# EAGLE design ESP (EAGLE 7.6.0)
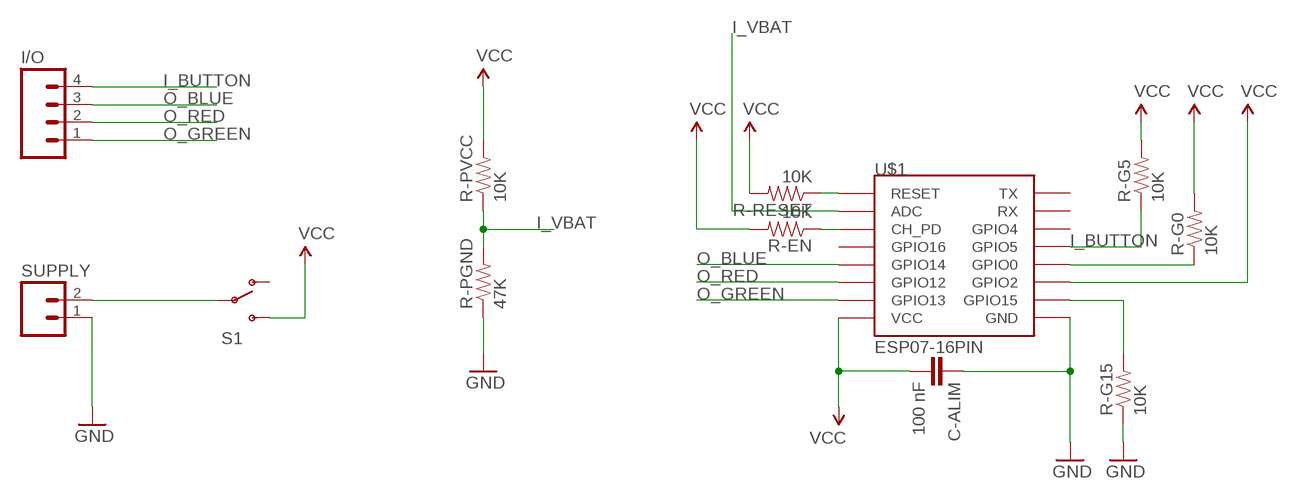
[diagram p0: schematic, sheet 1]

## Parts
C-ALIM  100 nF  CAP0805  [0805]
I/O  M04NO_SILK_ALL_ROUND  [1X04_NO_SILK_ALL_ROUND]
R-EN  10K  RESISTOR0805-RES  [0805]
R-G0  10K  RESISTOR0805-RES  [0805]
R-G5  10K  RESISTOR0805-RES  [0805]
R-G15  10K  RESISTOR0805-RES  [0805]
R-PGND  47K  RESISTOR0805-RES  [0805]
R-PVCC  10K  RESISTOR0805-RES  [0805]
R-RESET  10K  RESISTOR0805-RES  [0805]
S1  SWITCH-SPDTSMD2  [SWITCH-SPDT-SMD]
SUPPLY  M021X02_NO_SILK  [1X02_NO_SILK]
U$1  ESP07-16PIN  [ESP07-16PIN]

## Nets
GND: C-ALIM.1 R-G15.1 R-PGND.1 SUPPLY.1 U$1.GND
I_BUTTON: I/O.4 R-G5.1 U$1.GPIO5
I_VBAT: R-PGND.2 R-PVCC.1 U$1.ADC
N$1: R-G15.2 U$1.GPIO15
N$2 [SUPPLY]: S1.2(P) SUPPLY.2
N$6: R-G0.1 U$1.GPIO0
N$9: R-RESET.1 U$1.REST(RESET)
N$10: R-EN.1 U$1.CH_PD
O_BLUE: I/O.3 U$1.GPIO14
O_GREEN: I/O.1 U$1.GPIO13
O_RED: I/O.2 U$1.GPIO12
VCC [SUPPLY]: C-ALIM.2 R-EN.2 R-G0.2 R-G5.2 R-PVCC.2 R-RESET.2 S1.3(S) U$1.GPIO2 U$1.VCC
Unconnected: S1.1(O) U$1.GPIO4 U$1.GPIO16 U$1.RX U$1.TX

## Library data of the parts
C-ALIM = SparkFun-Capacitors:CAP: Capacitor Standard 0603 ceramic capacitor, and 0.1" leaded capacitor.
I/O = SparkFun-Connectors:M04: Header 4 Standard 4-pin 0.1" header. Use with straight break away headers (SKU : PRT-00116), right angle break away headers (PRT-00553), swiss pins (PRT-00743), machine pins (PRT-00117), and female headers (PRT-00115). Molex polarized connector foot print use with SKU : PRT-08231 with associated crimp pins and housings. 1MM SMD Version SKU: PRT-10208; PROD_ID: CONN-09696
R-EN R-G0 R-G5 R-G15 R-PGND R-PVCC R-RESET = SparkFun-Resistors:RESISTOR: Resistor Basic schematic elements and footprints for 0603, 1206, and PTH resistors.
S1 = lio:SWITCH-SPDT: SPDT Switch Simple slide switch, Spark Fun Electronics SKU : COM-00102 DPDT SMT slide switch, AYZ0202, SWCH-08179
SUPPLY = SparkFun-Connectors:M02: Standard 2-pin 0.1" header. Use with - straight break away headers ( PRT-00116) - right angle break away headers (PRT-00553) - swiss pins (PRT-00743) - machine pins (PRT-00117) - female headers (PRT-00115) Molex polarized connector foot print use with: PRT-08233 with associated crimp pins and housings. 2.54_SCREWTERM for use with PRT-10571. 3.5mm Screw Terminal footprints for PRT-08084 5mm Screw Terminal footprints for use with PRT-08432
U$1 = esp8266modules:ESP07-16PIN: ESP8266 Wifi module 07 - 16 pins; DIMENSIONS: 22.0 x 16.0 mm; PINS: 16; PITCH: 0.078" / 2 mm

## Net classes
0 default: width 0.3 mm
1 GND: width 0.5 mm, clearance 0.5 mm
2 SUPPLY: width 0.5 mm, clearance 0.003 mm

## Board
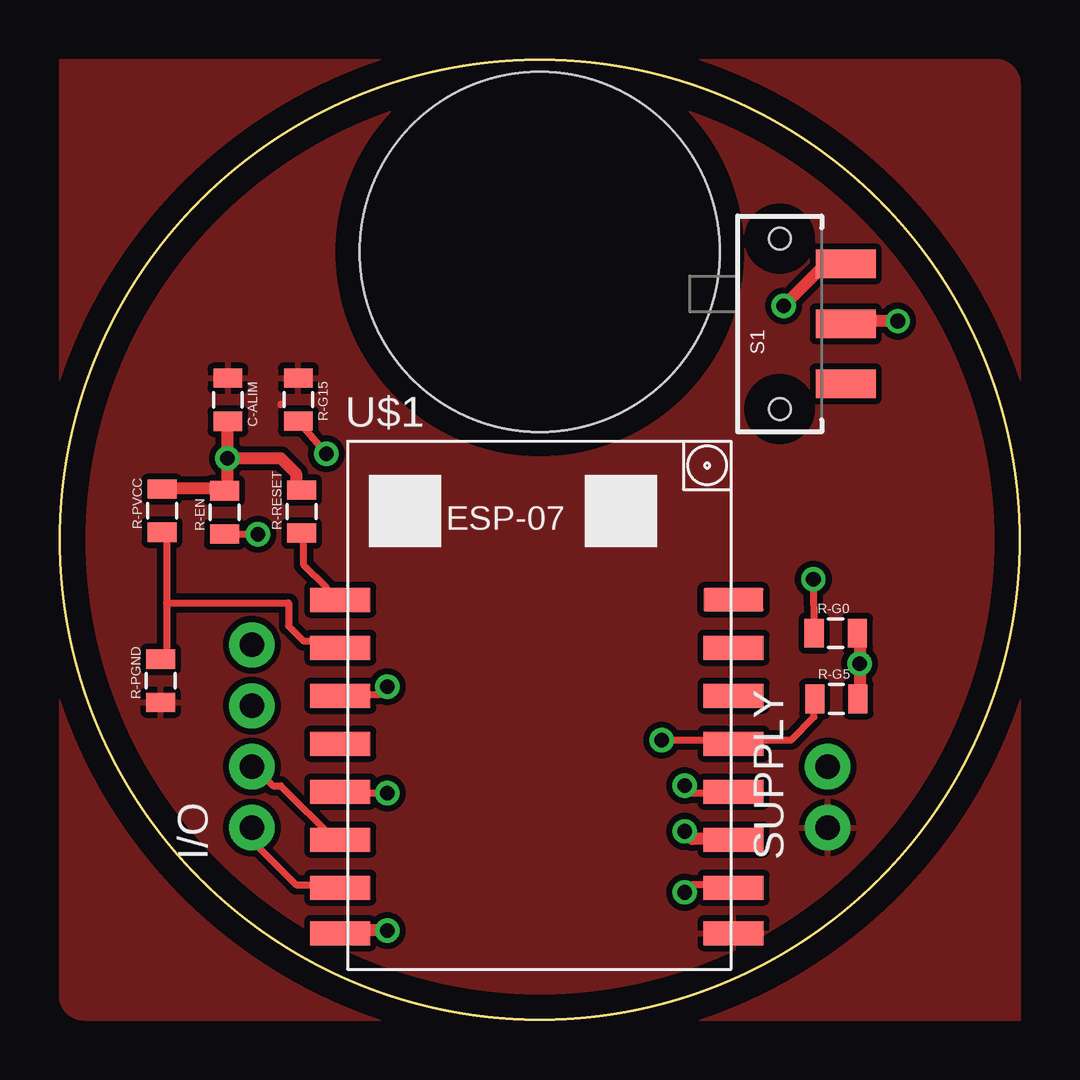
[diagram p1: board, top side]
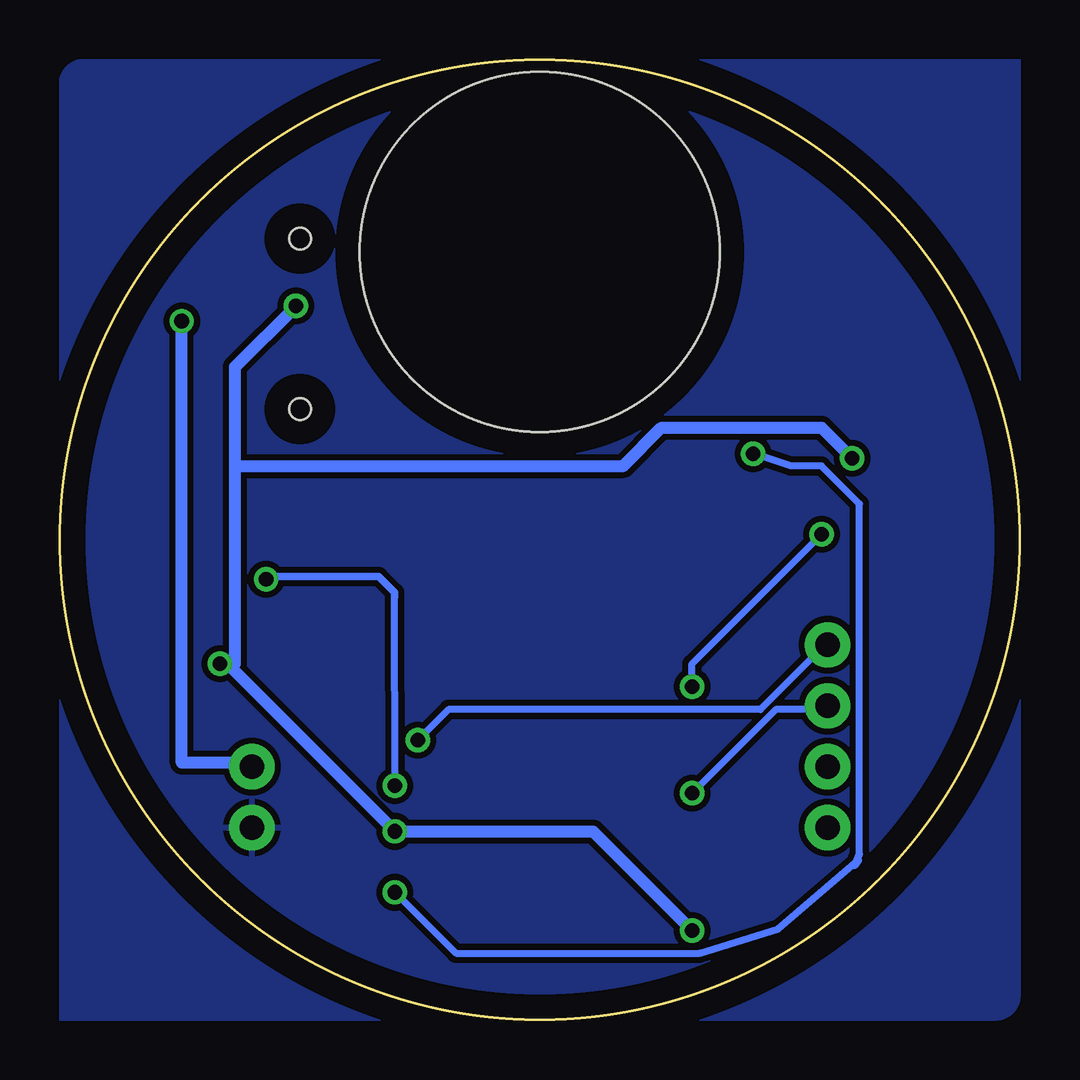
[diagram p2: board, bottom side, seen from below]

Size 40 x 40 mm. Coordinates in mm from the lower left corner, seen from the top.
Outline: circle at 20,20 radius 20
Copper layers (1*16): Top 0.035mm / dielectric 1.5mm / Bottom 0.035mm
Design rules "baballe": minimum track width 5mil, minimum drill 24mil, track to track 4mil, track to pad 4mil, pad to pad 4mil, via to via 4mil, smd to smd 2mil, copper to edge 40mil, drill to drill 8mil, minimum pad ring 10mil, minimum via ring 8mil, stop-mask expansion 4mil, vias tented up to drill 0mil, thermal gap 10mil
Holes 15 mm at 20,32

### Footprints (pad centres in the part's own frame; a part is rotated, then mirrored left to right if it is on the bottom)
0805 = smd 0.8 x 1.2: 1 -0.9,0; 2 0.9,0
1X04_NO_SILK_ALL_ROUND = drill 1.016 pad 1.88: 1 0,0; 2 2.54,0; 3 5.08,0; 4 7.62,0
SWITCH-SPDT-SMD = smd 1.2 x 2.5: 1 -2.5,-2.75; 2 0,-2.75; 3 2.5,-2.75 | hole 0.9: -3.55,0; 3.55,0
1X02_NO_SILK = drill 1.016 pad 1.88: 1 0,0; 2 2.54,0
ESP07-16PIN = smd 2.5 x 1: ADC -8.2,3.8; CH_PD -8.2,1.8; GND 8.2,-8.105; GPIO0 8.2,-2.2; GPIO2 8.2,-4.2; GPIO4 8.2,1.8; GPIO5 8.2,-0.2; GPIO12 -8.2,-4.2; GPIO13 -8.2,-6.2; GPIO14 -8.2,-2.2; GPIO15 8.2,-6.2; GPIO16 -8.2,-0.2; REST -8.2,5.8; RX 8.2,3.8; TX 8.2,5.8; VCC -8.2,-8.105

### Placement (x,y rotation side)
C-ALIM  7,25.83 270 top
I/O  8,8 90 top
R-EN  6.86,21.14 90 top
R-G0  32.34,16.1 0 top
R-G5  32.37,13.37 0 top
R-G15  9.94,25.84 270 top
R-PGND  4.2,14.12 90 top
R-PVCC  4.25,21.21 90 top
R-RESET  10.07,21.18 90 top
S1  30,29 90 top
SUPPLY  32,8 90 top
U$1  19.88,11.7 0 top

### Tracks (layer width: path | path; a pad name or v marks a point on that pad's centre or on a via)
GND
  Top 0.3: 9.21,25.62 9.21,25.65
  pour Top (isolate 0.254): 0,40 39,40 arc-90 40,39 40,0 1,0 arc-90 0,1
  pour Bottom (isolate 0.254): 0,40 39,40 arc-90 40,39 40,0 1,0 arc-90 0,1
I_BUTTON  (via drill 0.61)
  Top 0.3: R-G5.1 31.43,13.24 31.43,12.61 30.48,11.65 28.26,11.65 U$1.GPIO5 27.94,11.65 v25.08,11.65
  Bottom 0.3: v25.08,11.65 23.81,12.92 10.79,12.92 8.26,15.46 I/O.4
I_VBAT
  Top 0.3: 4.45,17.37 4.45,20.23 R-PVCC.1 | 4.45,17.37 4.45,15.14 R-PGND.2 | 4.45,17.37 9.53,17.37 9.53,16.41 10.16,15.78 11.43,15.78 U$1.ADC
N$1  (via drill 0.61)
  Top 0.3: v11.1,23.59 10.16,24.67 R-G15.2 | v26.04,5.3 26.35,5.62 27.94,5.62 U$1.GPIO15
  Bottom 0.3: v11.1,23.59 9.53,23.08 8.26,23.08 6.67,21.5 6.67,6.89 6.87,6.41 6.71,6.65 10.06,3.78 13.34,2.76 23.5,2.76 v26.04,5.3
N$2  (via drill 0.61)
  Top 0.5: v34.92,29.11 33.02,29.11 S1.2
  Bottom 0.5: v34.92,29.11 34.92,10.7 32.07,10.7 SUPPLY.2
N$6  (via drill 0.61)
  Top 0.3: v31.41,18.36 R-G0.1 | v26.04,9.75 26.35,9.43 27.94,9.43 U$1.GPIO0
  Bottom 0.3: v26.04,9.75 26.06,17.61
  Bottom 0.305: 26.06,17.61 26.06,17.81 26.72,18.47 31.29,18.47 v31.41,18.36
N$9
  Top 0.3: R-RESET.1 10.16,20.23 10.16,18.95 11.11,18 11.11,17.68 11.43,17.68 U$1.REST
N$10  (via drill 0.61)
  Top 0.3: v8.26,20.23 6.99,20.23 R-EN.1 | v13.65,13.88 13.34,13.56 11.75,13.56 U$1.CH_PD
  Bottom 0.3: v8.26,20.23 13.65,14.83 v13.65,13.88
O_BLUE  (via drill 0.61)
  Top 0.3: v13.65,9.43 11.75,9.43 U$1.GPIO14
  Bottom 0.3: v13.65,9.43 10.16,12.92 8.26,12.92 I/O.3
O_GREEN
  Top 0.3: U$1.GPIO13 11.43,5.62 9.84,5.62 8.26,7.21 8.26,7.84 I/O.1
O_RED
  Top 0.3: U$1.GPIO12 11.43,7.53 9.21,9.75 8.89,9.75 8.26,10.38 I/O.2
VCC  (via drill 0.61)
  Top 0.5: R-PVCC.2 4.45,22.13 6.67,22.13 R-EN.2 6.99,22.13 v6.99,23.4 | v6.99,23.4 6.99,24.67 C-ALIM.2 | v6.99,23.4 9.21,23.4 9.84,22.77 9.84,22.13 R-RESET.2 | R-G5.2 33.34,13.56 v33.34,14.83 33.34,16.1 R-G0.2 | v26.04,7.84 26.35,7.53 27.94,7.53 U$1.GPIO2 | v13.65,3.71 11.75,3.71 U$1.VCC | v30.16,29.75 31.75,31.34 32.7,31.34 S1.3
  Bottom 0.5: v33.34,14.83 33.02,14.83 32.86,14.67 | 32.86,14.67 v26.04,7.84 17.78,7.84 v13.65,3.71 | v30.16,29.75 32.7,27.21 32.7,23.08 | 32.7,23.08 32.7,14.83 32.86,14.67 | v6.99,23.4 8.26,24.67 14.92,24.67 16.51,23.08 32.7,23.08